# EAGLE schematic bricotester (EAGLE 6.5.0)
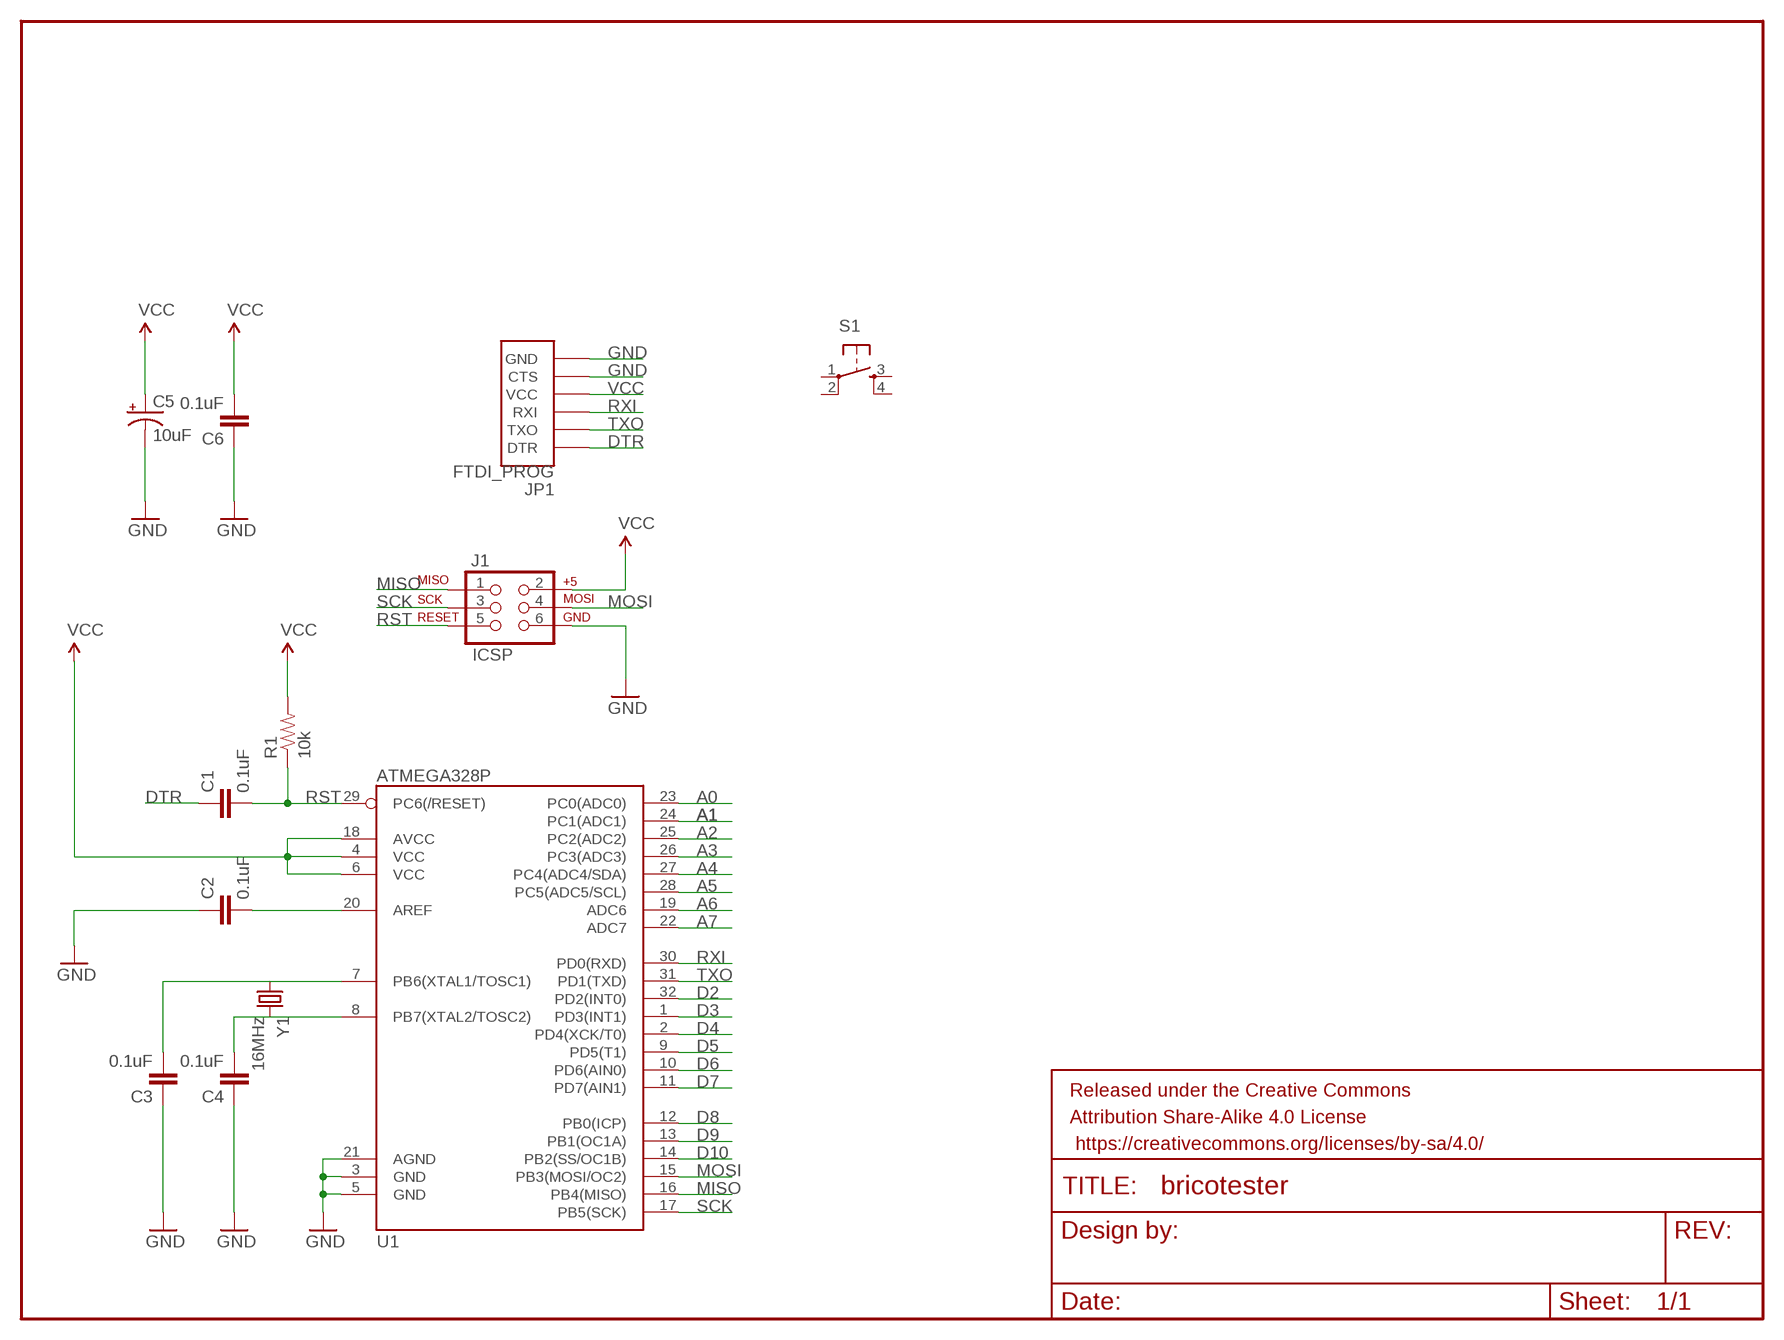
[diagram p0: schematic, sheet 1]

## Parts
C1  0.1uF  CAP1206  [1206]
C2  0.1uF  CAP1206  [1206]
C3  0.1uF  CAP1206  [1206]
C4  0.1uF  CAP1206  [1206]
C5  10uF  CAP_POLD  [PANASONIC_D]
C6  0.1uF  CAP1206  [1206]
FRAME1  FRAME-LETTER  [CREATIVE_COMMONS]
J1  ICSP  AVR_SPI_PRG_6PTH  [2X3]
JP1  FTDI_PROG  FTDI_DEVICE  [FTDI_DEVICE_SIDE]
R1  10k  RESISTOR0805-RES  [0805]
S1  TAC_SWITCHSMD  [TACTILE_SWITCH_SMD]
U1  ATMEGA328P  ATMEGA328_SMT  [TQFP32-08]
Y1  16MHz  CRYSTALSMD  [HC49UP]

## Nets
A0: U1.23(PC0(ADC0))
A1: U1.24(PC1(ADC1))
A2: U1.25(PC2(ADC2))
A3: U1.26(PC3(ADC3))
A4: U1.27(PC4(ADC4/SDA))
A5: U1.28(PC5(ADC5/SCL))
A6: U1.19(ADC6)
A7: U1.22(ADC7)
D2: U1.32(PD2(INT0))
D3: U1.1(PD3(INT1))
D4: U1.2(PD4(XCK/T0))
D5: U1.9(PD5(T1))
D6: U1.10(PD6(AIN0))
D7: U1.11(PD7(AIN1))
D8: U1.12(PB0(ICP))
D9: U1.13(PB1(OC1A))
D10: U1.14(PB2(SS/OC1B))
DTR: C1.1 JP1.P$1(DTR)
GND: C2.1 C3.1 C4.1 C5.- C6.1 J1.6 JP1.P$5(CTS) JP1.P$6(GND) U1.3(GND) U1.5(GND) U1.21(AGND)
MISO: J1.1 U1.16(PB4(MISO))
MOSI: J1.4 U1.15(PB3(MOSI/OC2))
N$1: C3.2 U1.7(PB6(XTAL1/TOSC1)) Y1.1
N$2: C4.2 U1.8(PB7(XTAL2/TOSC2)) Y1.2
N$3: C2.2 U1.20(AREF)
RST: C1.2 J1.5 R1.1 U1.29(PC6(/RESET))
RXI: JP1.P$3(RXI) U1.30(PD0(RXD))
SCK: J1.3 U1.17(PB5(SCK))
TXO: JP1.P$2(TXO) U1.31(PD1(TXD))
VCC: C5.+ C6.2 J1.2 JP1.P$4(VCC) R1.2 U1.4(VCC) U1.6(VCC) U1.18(AVCC)
Unconnected: S1.1 S1.2 S1.3 S1.4

## Library data of the parts
C1-C4 C6 = SparkFun-Passives:CAP: Capacitor Standard 0603 ceramic capacitor, and 0.1" leaded capacitor.
C5 = SparkFun-Passives:CAP_POL: Capacitor Polarized These are standard SMD and PTH capacitors. Normally 10uF, 47uF, and 100uF in electrolytic and tantalum varieties. Always verify the external diameter of the through hole cap, it varies with capacity, voltage, and manufacturer. The EIA devices should be standard.
FRAME1 = SparkFun-Aesthetics:FRAME-LETTER: Schematic Frame Standard 8.5x11 US Letter frame
J1 = SparkFun-Connectors:AVR_SPI_PRG_6: AVR ISP 6 Pin This is the reduced ISP connector for AVR programming. Common on Arduino. This footprint will take up less PCB space and can be used with a 10-pin to 6-pin adapter such as SKU: BOB-08508
JP1 = SparkFun-Connectors:FTDI_DEVICE: Connector which mates to FTDI basic or FTDI cable.
R1 = SparkFun-Passives:RESISTOR: Resistor Basic schematic elements and footprints for 0603, 1206, and PTH resistors.
S1 = SparkFun-Electromechanical:TAC_SWITCH: Momentary Switch Button commonly used for reset or general input. Spark Fun Electronics SKU : COM-00097 SMT- SWCH-08247; PROD_ID: SWCH-08247
U1 = SparkFun-DigitalIC:ATMEGA328_SMT: 32-Pin Atmega328 part Commonly used on Arduino compatible boards Available in QFP and QFN packages TQFP is IC-09069 QFN is non-stock; PROD_ID: IC-09069
Y1 = SparkFun-FreqCtrl:CRYSTAL: Various standard crystals. Proven footprints. Spark Fun Electronics SKU : COM-00534